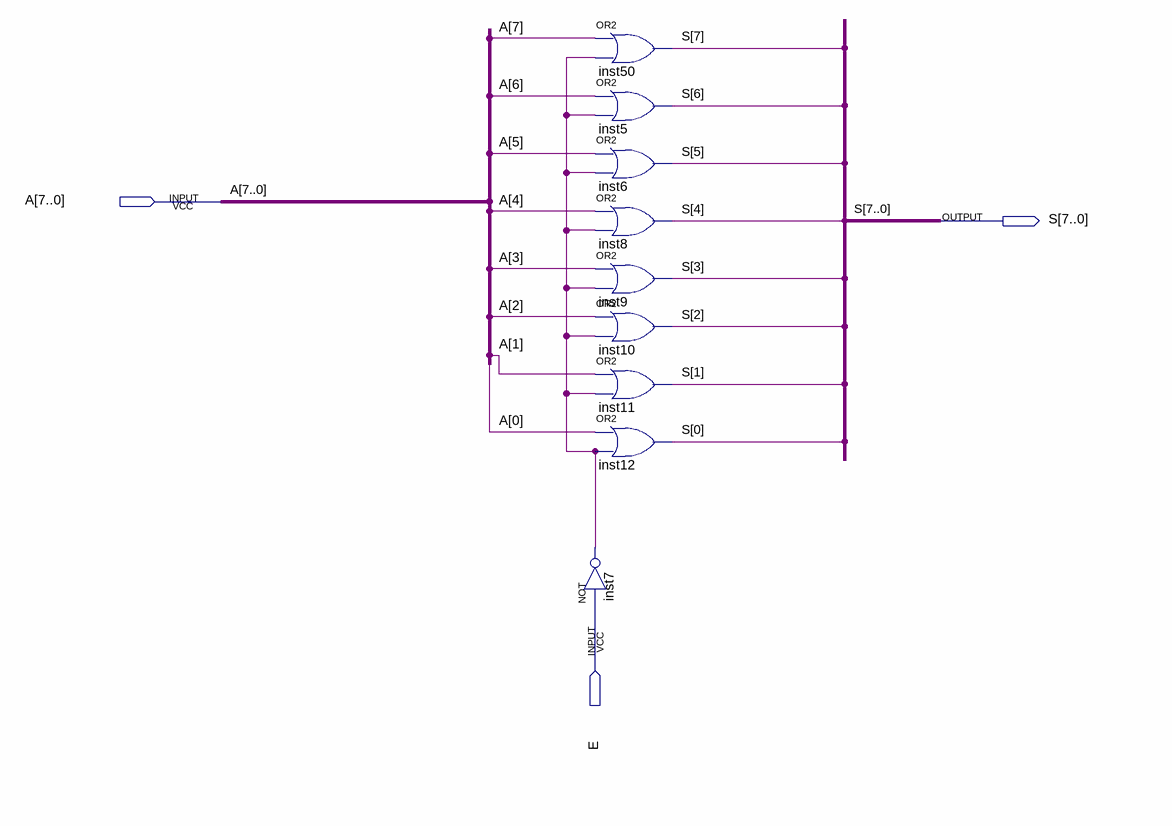
[diagram p0: schematic sheet]
// Quartus schematic isdisplay.bdf as structural Verilog: 9 symbols, 3 pins
module isdisplay (
  input  [7:0] A,
  input  E,
  output [7:0] S
);

  wire inst7_out;

  or inst50 (S[7], A[7], inst7_out);
  or inst5 (S[6], A[6], inst7_out);
  or inst6 (S[5], A[5], inst7_out);
  or inst8 (S[4], A[4], inst7_out);
  or inst9 (S[3], A[3], inst7_out);
  or inst10 (S[2], A[2], inst7_out);
  or inst11 (S[1], A[1], inst7_out);
  or inst12 (S[0], A[0], inst7_out);
  not inst7 (inst7_out, E);
endmodule
